# Altium schematic sheet Schematic1P1.schdoc
size 594 x 419 mm; Symbol: Drawing-Symbol_A2; @Project Name: control; @Page Count: 1; @Update Date: 2026-10-01; @Create Date: 2026-09-30; @Schematic Name: Schematic1; @Page No: 1; @Page Name: P1; Company: EasyEDA.com; Version: V1.0; Page Size: A2; Device: Drawing-Symbol_A2; @Create Time: 06:52:32; @Update Time: 20:35:59; Border: 1; Width: 2338; Height: 1652; Region Start: 1; X Region Count: 6; Y Region Count: 4; Blade Width: 10; Title Block Position: 3; @Board Name: Board1
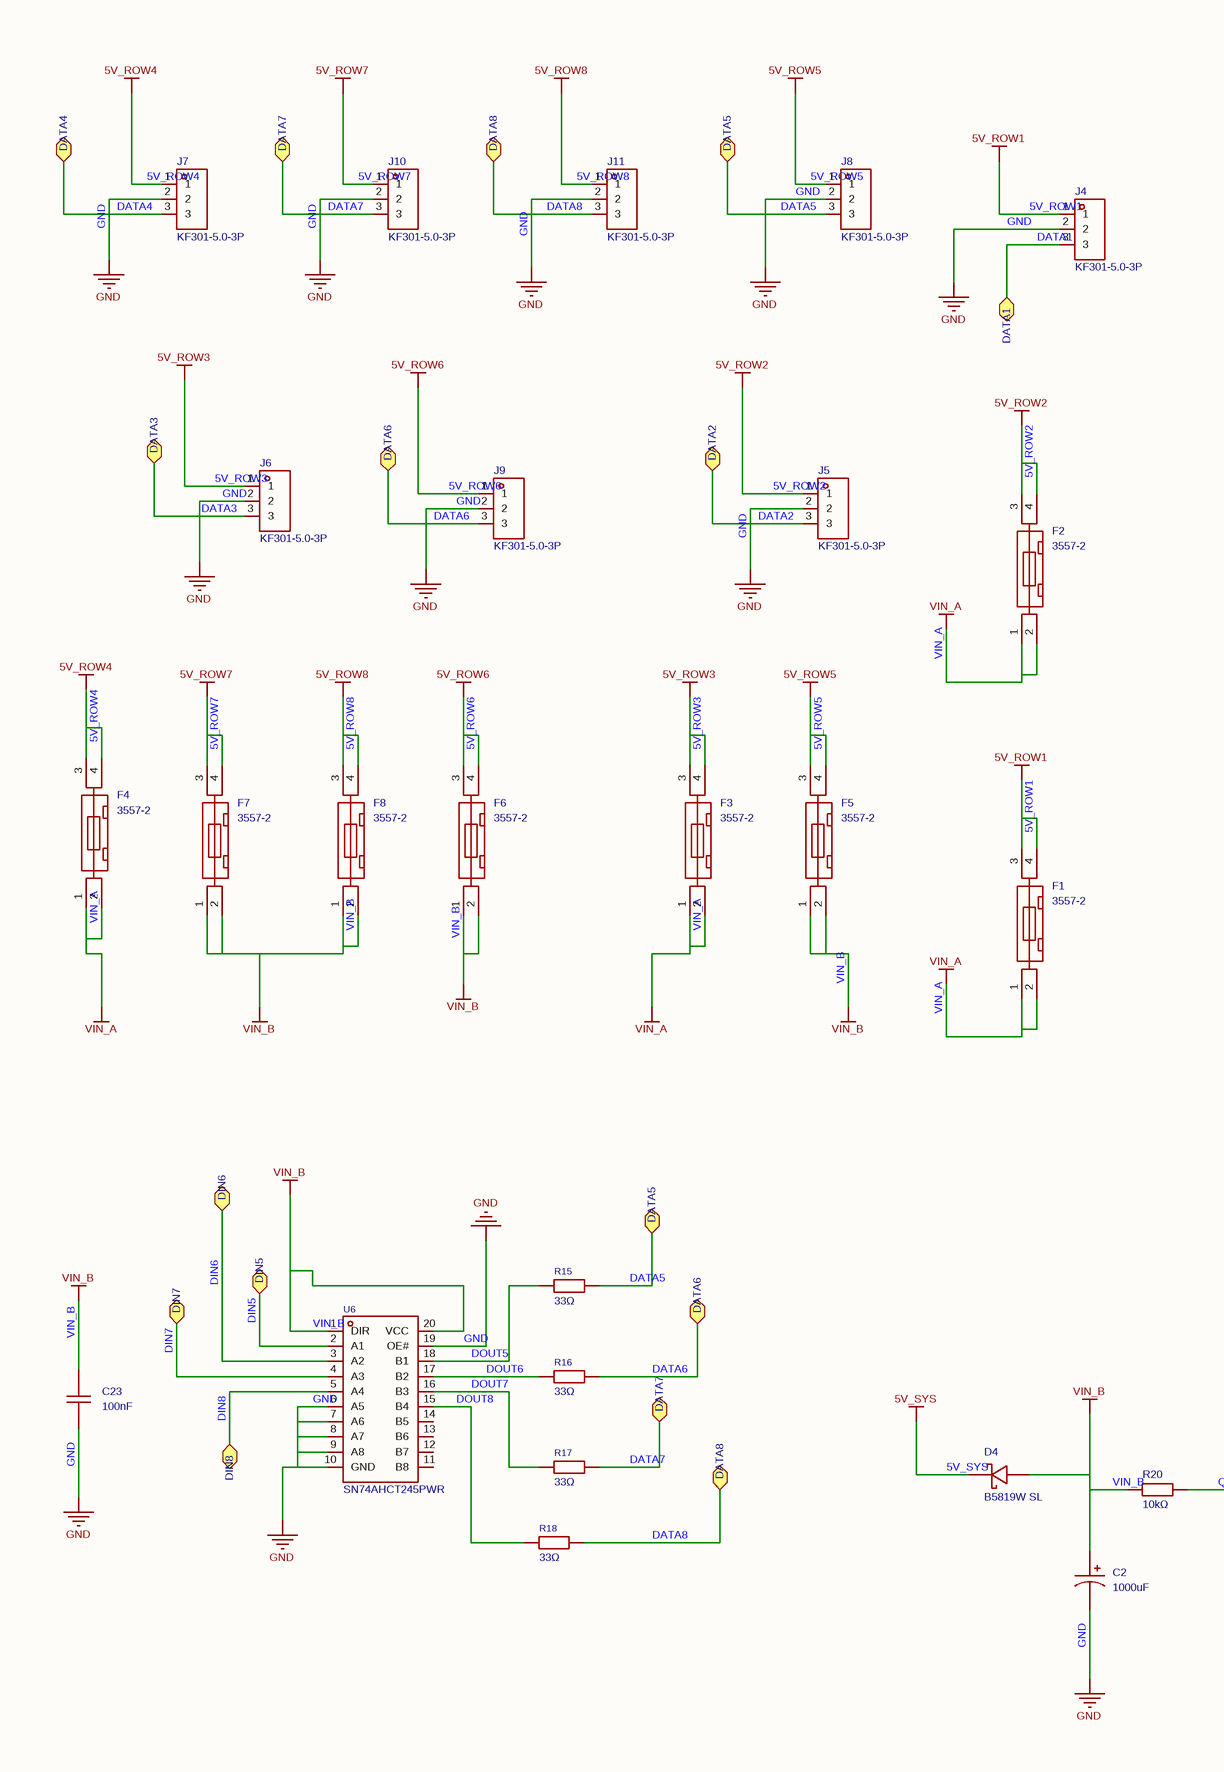
[diagram p0: Schematic1P1.schdoc, left]
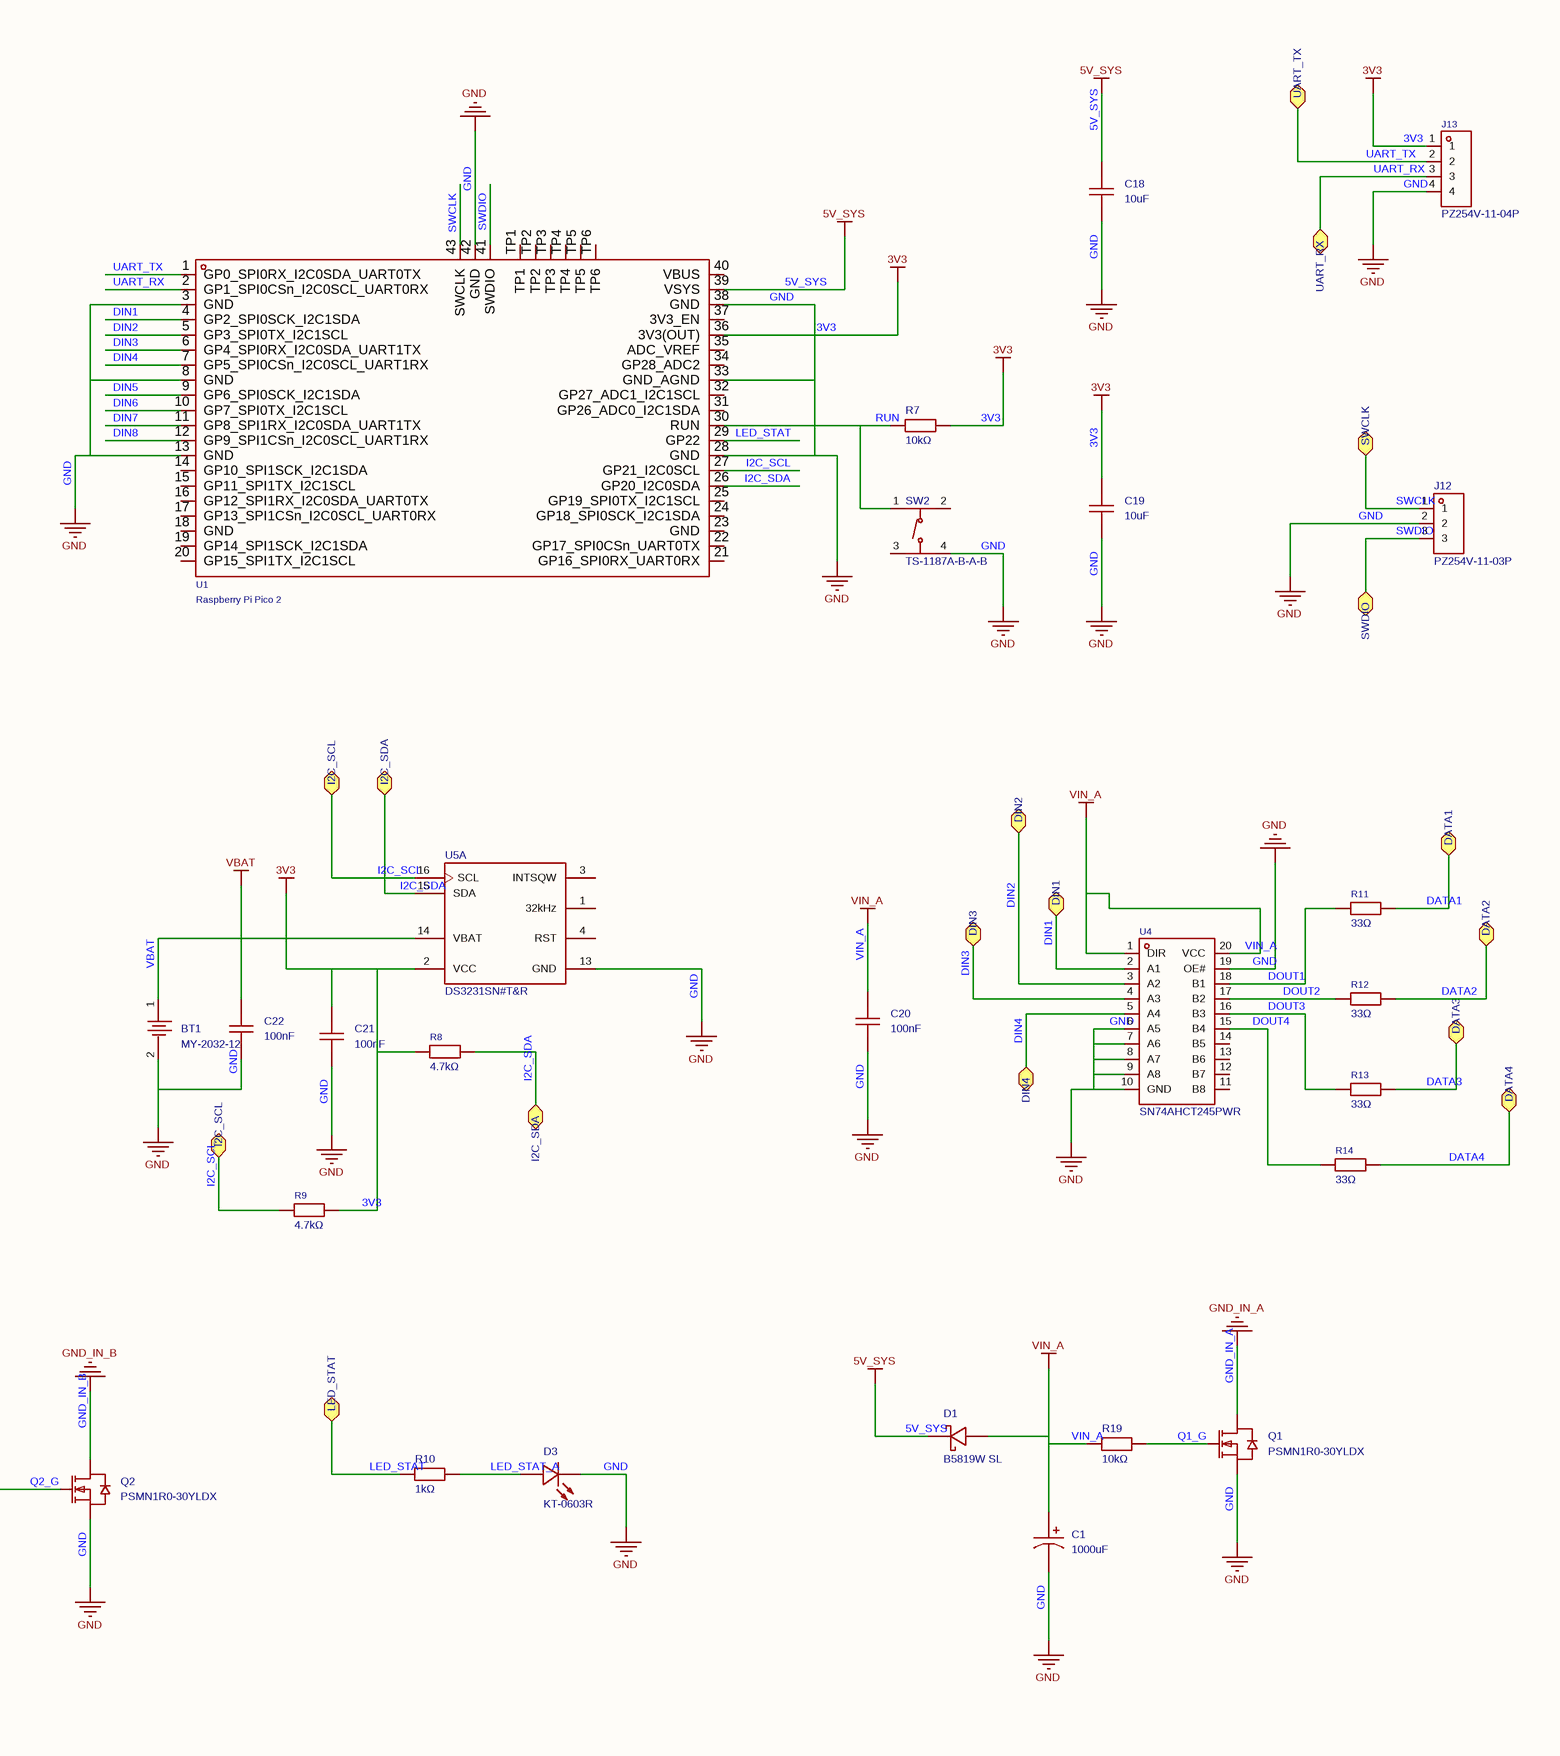
[diagram p1: Schematic1P1.schdoc, right]

## Parts
BT1  MY-2032-12  [BAT-SMD_MY-2032-12]
C1  1000uF  [CAP-SMD_BD10.0-L10.3-W10.3-FD]
C2  1000uF  [CAP-SMD_BD10.0-L10.3-W10.3-FD]
C18  10uF  [C0805]
C19  10uF  [C0805]
C20  100nF  [C0402]
C21  100nF  [C0402]
C22  100nF  [C0402]
C23  100nF  [C0402]
D1  B5819W SL  [SOD-123_L2.7-W1.6-LS3.7-RD-1]
D3  KT-0603R  [LED-SMD_L1.6-W0.8-R-RD]
D4  B5819W SL  [SOD-123_L2.7-W1.6-LS3.7-RD-1]
F1  3557-2  [FUSE-TH_4P-L19.8-W6.7_3557-2]
F2  3557-2  [FUSE-TH_4P-L19.8-W6.7_3557-2]
F3  3557-2  [FUSE-TH_4P-L19.8-W6.7_3557-2]
F4  3557-2  [FUSE-TH_4P-L19.8-W6.7_3557-2]
F5  3557-2  [FUSE-TH_4P-L19.8-W6.7_3557-2]
F6  3557-2  [FUSE-TH_4P-L19.8-W6.7_3557-2]
F7  3557-2  [FUSE-TH_4P-L19.8-W6.7_3557-2]
F8  3557-2  [FUSE-TH_4P-L19.8-W6.7_3557-2]
J4  KF301-5.0-3P  [CONN-TH_3P-P5.00_KF301-5.0-3P]
J5  KF301-5.0-3P  [CONN-TH_3P-P5.00_KF301-5.0-3P]
J6  KF301-5.0-3P  [CONN-TH_3P-P5.00_KF301-5.0-3P]
J7  KF301-5.0-3P  [CONN-TH_3P-P5.00_KF301-5.0-3P]
J8  KF301-5.0-3P  [CONN-TH_3P-P5.00_KF301-5.0-3P]
J9  KF301-5.0-3P  [CONN-TH_3P-P5.00_KF301-5.0-3P]
J10  KF301-5.0-3P  [CONN-TH_3P-P5.00_KF301-5.0-3P]
J11  KF301-5.0-3P  [CONN-TH_3P-P5.00_KF301-5.0-3P]
J12  PZ254V-11-03P  [HDR-TH_3P-P2.54-V-M]
J13  PZ254V-11-04P  [HDR-TH_4P-P2.54-V-M]
Q1  PSMN1R0-30YLDX  [LFPAK56-4_L4.9-W4.2-P1.27-LS6.2-BL]
Q2  PSMN1R0-30YLDX  [LFPAK56-4_L4.9-W4.2-P1.27-LS6.2-BL]
R7  10kΩ  [R0402]
R8  4.7kΩ  [R0402]
R9  4.7kΩ  [R0402]
R10  1kΩ  [R0402]
R11  33Ω  [R0402]
R12  33Ω  [R0402]
R13  33Ω  [R0402]
R14  33Ω  [R0402]
R15  33Ω  [R0402]
R16  33Ω  [R0402]
R17  33Ω  [R0402]
R18  33Ω  [R0402]
R19  10kΩ  [R0402]
R20  10kΩ  [R0402]
SW2  TS-1187A-B-A-B  [SW-SMD_4P-L5.1-W5.1-P3.70-LS6.5-TL_H1.5]
U1  Raspberry Pi Pico 2  [COMM-SMD_L51.0-W21.0-P2.54_SC0916]
U4  SN74AHCT245PWR  [TSSOP-20_L6.5-W4.4-P0.65-LS6.4-BL]
U5  DS3231SN#T&R  [SOIC-16_L10.3-W7.5-P1.27-LS10.3-BL]  (part A of 2)
U6  SN74AHCT245PWR  [TSSOP-20_L6.5-W4.4-P0.65-LS6.4-BL]

## Ports
DATA1 (bidir), DATA2 (bidir), DATA3 (bidir), DATA4 (bidir), DATA5 (bidir), DATA6 (bidir), DATA7 (bidir), DATA8 (bidir), DIN1 (bidir), DIN2 (bidir), DIN3 (bidir), DIN4 (bidir), DIN5 (bidir), DIN6 (bidir), DIN7 (bidir), DIN8 (bidir), I2C_SCL (bidir), I2C_SDA (bidir), LED_STAT (bidir), SWCLK (bidir), SWDIO (bidir), UART_RX (bidir), UART_TX (bidir)

## Nets
3V3: C19.1 C21.1 J13.1 R7.2 R8.2 R9.2 U1.36(3V3(OUT)) U5.2(VCC)
5V_ROW1: F1.3 F1.4 J4.1
5V_ROW2: F2.3 F2.4 J5.1
5V_ROW3: F3.3 F3.4 J6.1
5V_ROW4: F4.3 F4.4 J7.1
5V_ROW5: F5.3 F5.4 J8.1
5V_ROW6: F6.3 F6.4 J9.1
5V_ROW7: F7.3 F7.4 J10.1
5V_ROW8: F8.3 F8.4 J11.1
5V_SYS: C18.1 D1.1(-) D4.1(-) U1.39(VSYS)
GND: BT1.2 C1.2 C2.2 C18.2 C19.2 C20.2 C21.2 C22.2 C23.2 D3.2(K) J4.2 J5.2 J6.2 J7.2 J8.2 J9.2 J10.2 J11.2 J12.2 J13.4 Q1.1(S) Q1.2(S) Q1.3(S) Q2.1(S) Q2.2(S) Q2.3(S) SW2.4(D) U1.3(GND) U1.8(GND) U1.13(GND) U1.28(GND) U1.33(GND_AGND) U1.38(GND) U1.42(GND) U4.6(A5) U4.7(A6) U4.8(A7) U4.9(A8) U4.10(GND) U4.19(OE#) U5.13(GND) U6.6(A5) U6.7(A6) U6.8(A7) U6.9(A8) U6.10(GND) U6.19(OE#)
GND_IN_A: Q1.5(D)
GND_IN_B: Q2.5(D)
VBAT: BT1.1 C22.1 U5.14(VBAT)
VIN_A: C1.1 C20.1 D1.2(+) F1.1 F1.2 F2.1 F2.2 F3.1 F3.2 F4.1 F4.2 R19.1 U4.1(DIR) U4.20(VCC)
VIN_B: C2.1 C23.1 D4.2(+) F5.1 F5.2 F6.1 F6.2 F7.1 F7.2 F8.1 F8.2 R20.1 U6.1(DIR) U6.20(VCC)
DATA1: J4.3 R11.2 ; port DATA1
DATA2: J5.3 R12.2 ; port DATA2
DATA3: J6.3 R13.2 ; port DATA3
DATA4: J7.3 R14.2 ; port DATA4
DATA5: J8.3 R15.2 ; port DATA5
DATA6: J9.3 R16.2 ; port DATA6
DATA7: J10.3 R17.2 ; port DATA7
DATA8: J11.3 R18.2 ; port DATA8
DIN1: U1.4(GP2_SPI0SCK_I2C1SDA) U4.2(A1) ; port DIN1
DIN2: U1.5(GP3_SPI0TX_I2C1SCL) U4.3(A2) ; port DIN2
DIN3: U1.6(GP4_SPI0RX_I2C0SDA_UART1TX) U4.4(A3) ; port DIN3
DIN4: U1.7(GP5_SPI0CSn_I2C0SCL_UART1RX) U4.5(A4) ; port DIN4
DIN5: U1.9(GP6_SPI0SCK_I2C1SDA) U6.2(A1) ; port DIN5
DIN6: U1.10(GP7_SPI0TX_I2C1SCL) U6.3(A2) ; port DIN6
DIN7: U1.11(GP8_SPI1RX_I2C0SDA_UART1TX) U6.4(A3) ; port DIN7
DIN8: U1.12(GP9_SPI1CSn_I2C0SCL_UART1RX) U6.5(A4) ; port DIN8
DOUT1: R11.1 U4.18(B1)
DOUT2: R12.1 U4.17(B2)
DOUT3: R13.1 U4.16(B3)
DOUT4: R14.1 U4.15(B4)
DOUT5: R15.1 U6.18(B1)
DOUT6: R16.1 U6.17(B2)
DOUT7: R17.1 U6.16(B3)
DOUT8: R18.1 U6.15(B4)
I2C_SCL: R9.1 U1.27(GP21_I2C0SCL) U5.16(SCL) ; port I2C_SCL
I2C_SDA: R8.1 U1.26(GP20_I2C0SDA) U5.15(SDA) ; port I2C_SDA
LED_STAT: R10.1 U1.29(GP22) ; port LED_STAT
LED_STAT_A: D3.1(A) R10.2
Q1_G: Q1.4(G) R19.2
Q2_G: Q2.4(G) R20.2
RUN: R7.1 SW2.1(A) U1.30(RUN)
SWCLK: J12.1 U1.43(SWCLK) ; port SWCLK
SWDIO: J12.3 U1.41(SWDIO) ; port SWDIO
UART_RX: J13.3 U1.2(GP1_SPI0CSn_I2C0SCL_UART0RX) ; port UART_RX
UART_TX: J13.2 U1.1(GP0_SPI0RX_I2C0SDA_UART0TX) ; port UART_TX

Not connected (* = marked no-connect by the designer): SW2 2(B) 3(C); U1 14(GP10_SPI1SCK_I2C1SDA) 15(GP11_SPI1TX_I2C1SCL) 16(GP12_SPI1RX_I2C0SDA_UART0TX) 17(GP13_SPI1CSn_I2C0SCL_UART0RX) 18(GND) 19(GP14_SPI1SCK_I2C1SDA) 20(GP15_SPI1TX_I2C1SCL) 21(GP16_SPI0RX_UART0RX) 22(GP17_SPI0CSn_UART0TX) 23(GND) 24(GP18_SPI0SCK_I2C1SDA) 25(GP19_SPI0TX_I2C1SCL) 31(GP26_ADC0_I2C1SDA) 32(GP27_ADC1_I2C1SCL) 34(GP28_ADC2) 35(ADC_VREF) 37(3V3_EN) 40(VBUS) TP1 TP2 TP3 TP4 TP5 TP6; U4 11(B8) 12(B7) 13(B6) 14(B5); U5 1(32kHz) 3(INTSQW) 4(RST); U6 11(B8) 12(B7) 13(B6) 14(B5)

## Notes on the sheet
- Create at
- 2026-09-30
- Schematic
- Board
- Schematic1
- Board1
- Update at
- Page
- 2026-10-01
- P1
- Drawn
- Reviewed
- control
- Version
- V1.0
- Size
- A2
- Page  1  Total  1
- EasyEDA.com

## Library data of the parts
BT1 = MY-2032-12: Type:Battery buckle Operating Temperature:-25~85℃ Contact material:Phosphor bronze Contact coating:Nickel plated Applicable battery specifications:CR2032; Manufacturer: MYOUNG(美阳); EasyEDA Copilot Part Ref: {"uuid":"aa792aee71034bd68fc694e556458b92","libraryUuid":"lcsc"}; Add into BOM: yes; 3D Model: 5e9d120b88ab4f8a9db96ba1f5cb4900; 3D Model Transform: 948.817,617.76239,0,0,0,0,0,0,0; Applicable battery specifications: CR2032; Symbol: MY-2032-12; Device: MY-2032-12; Convert to PCB: yes; LCSC Part Name: MYOUNG(美阳)电池扣CR2032-P28 24.1MM 卧式SMT回流焊工艺标准 T=0.25 适配CR/LIR/ML2032电池; Supplier Part: C964833; Manufacturer Part: MY-2032-12; Supplier Footprint: -; JLCPCB Part Class: Extended Part; Datasheet: https://item.szlcsc.com/datasheet/MY-2032-12/1049799.html; Supplier: LCSC; Type: Battery buckle; Operating Temperature: -25~85℃; Contact material: Phosphor bronze; Contact coating: Nickel plated; FootprintName: BAT-SMD_MY-2032-12; ModelName: BAT-SMD_MY-2032-12
C1 C2 = RVT1C102M1010 1000UF 16V: Capacitance:1000uF Tolerance:±20% Tolerance:±20% Voltage Rating:16V Ripple Current:347mA@120Hz Equivalent Series Resistance(ESR):- Diameter:10mm Height - Seated (Max):10.2mm Lifetime:2800hrs@105℃ Operating Temperature:-55℃~+105℃ Operating Temperature:-55℃; Manufacturer: DMBJ(振宝佳); EasyEDA Copilot Part Ref: {"uuid":"ecdc1e1f0322484094d94e682efabee2","libraryUuid":"lcsc"}; Symbol: RVT1C102M1010_C970714; Add into BOM: yes; 3D Model: f9399d38f4bf4dafaa6a7aeba7f82438; 3D Model Transform: 456.692,405.511,0,180,0,0,0,0,0; Tolerance: ±20%; Voltage Rating: 16V; Device: RVT1C102M1010 1000UF 16V; Convert to PCB: yes; LCSC Part Name: 1000uF ±20% 16V; Supplier Part: C970714; Manufacturer Part: RVT1C102M1010 1000UF 16V; Supplier Footprint: SMD,D10xL10.2mm; JLCPCB Part Class: Extended Part; Datasheet: https://item.szlcsc.com/datasheet/RVT1C102M1010%25201000UF%252016V/1060442.html; Supplier: LCSC; Value: 1000uF; Ripple Current: 347mA@120Hz; Equivalent Series Resistance(ESR): -; Diameter: 10mm; Height - Seated (Max): 10.2mm; Lifetime: 2800hrs@105℃; Operating Temperature: -55℃~+105℃; FootprintName: CAP-SMD_BD10.0-L10.3-W10.3-FD; ModelName: CAP-SMD_BD10.0-L10.3-W10.3-FD
C18 C19 = CL21A106KAYNNNE_C15850: Capacitance:10uF Tolerance:±10% Tolerance:±10% Voltage Rating:25V Temperature Coefficient:X5R; Manufacturer: SAMSUNG(三星); EasyEDA Copilot Part Ref: {"uuid":"e10bc30d72324129a5b7daae4e75f56f","libraryUuid":"lcsc"}; Add into BOM: yes; 3D Model: 8c88e81f49c6409b980720ec8953afb6; 3D Model Transform: 78.74,51.181,0,0,0,0,0,0.0005,0; Tolerance: ±10%; Voltage Rating: 25V; Temperature Coefficient: X5R; ModelName: C0805_L2.0-W1.3-H1.3; Symbol: CL21A106KAYNNNE; Device: CL21A106KAYNNNE_C15850; Convert to PCB: yes; LCSC Part Name: 10uF ±10% 25V; Supplier Part: C15850; Manufacturer Part: CL21A106KAYNNNE; Supplier Footprint: 0805; JLCPCB Part Class: Basic Part; Datasheet: https://item.szlcsc.com/datasheet/CL21A106KAYNNNE/16532.html; Supplier: LCSC; Value: 10uF; FootprintName: C0805
C20-C23 = CL05B104KO5NNNC: Capacitance:100nF Tolerance:±10% Tolerance:±10% Voltage Rating:16V Temperature Coefficient:X7R; Manufacturer: SAMSUNG(三星); EasyEDA Copilot Part Ref: {"uuid":"2eaf9ba597d94b93917d2b625402739a","libraryUuid":"lcsc"}; Add into BOM: yes; 3D Model: b7d13df3e9464d7a99d0651d1a5b4d57; 3D Model Transform: 39.37,19.685,0,0,0,0,0,0,0; Tolerance: ±10%; Voltage Rating: 16V; Temperature Coefficient: X7R; ModelName: C0402_L1.0-W0.5-H0.5; Symbol: CL05B104KO5NNNC; Device: CL05B104KO5NNNC; Convert to PCB: yes; LCSC Part Name: 100nF ±10% 16V; Supplier Part: C1525; Manufacturer Part: CL05B104KO5NNNC; Supplier Footprint: 0402; JLCPCB Part Class: Basic Part; Datasheet: https://item.szlcsc.com/datasheet/CL05B104KO5NNNC/1877.html; Supplier: LCSC; Value: 100nF; FootprintName: C0402
D1 D4 = B5819W SL: Voltage - Forward(Vf@If):600mV@1A Voltage - DC Reverse(Vr):40V Current - Rectified:1A Non-Repetitive Peak Forward Surge Current:9A; Manufacturer: CJ(江苏长电/长晶); EasyEDA Copilot Part Ref: {"uuid":"dcfb33231bcc4449a01b4bb8a60e3d79","libraryUuid":"lcsc"}; Symbol: B5819W_C8598; Add into BOM: yes; 3D Model: 5a61cd31046d4447ba73169a45a0935b; 3D Model Transform: 151.575,66.929,0,0,0,0,0,0,0; Voltage - DC Reverse(Vr): 40V; Current - Rectified: 1A; Non-Repetitive Peak Forward Surge Current: 9A; Device: B5819W SL; Convert to PCB: yes; LCSC Part Name: 电压:40V 电流:1A; Supplier Part: C8598; Manufacturer Part: B5819W SL; Supplier Footprint: SOD-123; JLCPCB Part Class: Basic Part; Datasheet: https://item.szlcsc.com/datasheet/B5819W%2520SL/9093.html; Supplier: LCSC; Voltage - Forward(Vf@If): 600mV@1A; FootprintName: SOD-123_L2.7-W1.6-LS3.7-RD-1; ModelName: SOD-123_L2.7-W1.6-LS3.7-RD-1
D3 = KT-0603R: Lamp Holder Type:1.6mm x 0.8mm square LED Illumination Color:Red Voltage - Forward(Vf):1.8V~2.4V Voltage - Forward(Vf):1.8V~2.4V Power(Watts):40mW Forward Current:20mA Wavelength - Dominant:615nm~630nm Wavelength - Dominant:615nm~630nm Peak Wavelength:645; Manufacturer: KENTO; EasyEDA Copilot Part Ref: {"uuid":"015cbd77079d4b0ea5c81b79fefdcea3","libraryUuid":"lcsc"}; Add into BOM: yes; 3D Model: 19cc79473bbc420a8203ad67d1a57d42; 3D Model Transform: 63.7794,31.496,0,0,0,0,0,0,0; Illumination Color: Red; Power(Watts): 40mW; Forward Current: 20mA; Peak Wavelength: 645nm; Diode Configuration: Discrete Diode; Lens Color: Water Clear; Luminous Intensity: 300mcd; Viewing Angle: 120°; ModelName: LED0603_L1.6-W0.8-H0.6; Symbol: KT-0603R; Device: KT-0603R; Convert to PCB: yes; LCSC Part Name: 0603 红灯 高亮; Supplier Part: C2286; Manufacturer Part: KT-0603R; Supplier Footprint: 0603; JLCPCB Part Class: Basic Part; Datasheet: https://item.szlcsc.com/datasheet/KT-0603R/2659.html; Supplier: LCSC; Lamp Holder Type: 1.6mm x 0.8mm square LED; Voltage - Forward(Vf): 1.8V~2.4V; Wavelength - Dominant: 615nm~630nm; Color Temperature: -; Mounting Style: -; Operating Temperature: -40℃~+85℃; FootprintName: LED-SMD_L1.6-W0.8-R-RD
F1-F8 = 3557-2: Fuseholder Type:Bracket type Number of Circuits:1 Voltage Rating:500V Current Rating:30A Fuse Type:Blade; Manufacturer: Keystone; EasyEDA Copilot Part Ref: {"uuid":"5841bf4d38b740719161dcaa374993cc","libraryUuid":"lcsc"}; Add into BOM: yes; 3D Model: f7701db4c1d948578b2a7da261242b5d; 3D Model Transform: 779.9984,265.39313,0,0,0,0,0,0,-110.236; Number of Circuits: 1; Voltage Rating: 500V; Current Rating: 30A; Fuse Type: Blade; Symbol: 3557-2; Device: 3557-2; Convert to PCB: yes; LCSC Part Name: 30A 500V 支座型; Supplier Part: C352820; Manufacturer Part: 3557-2; Supplier Footprint: -; JLCPCB Part Class: Extended Part; Datasheet: https://item.szlcsc.com/datasheet/3557-2/328627.html; Supplier: LCSC; Fuseholder Type: Bracket type; FootprintName: FUSE-TH_4P-L19.8-W6.7_3557-2; ModelName: FUSE-TH_4P-L19.8-W6.7_3557-2
J4-J11 = KF301-5.0-3P: Number of Positions or Pins:1x3P Pitch:5mm Color:Blue Mounting Type:Through Hole Number of Pins:3P Number of Rows:1 Number of PINs Per Row:3 Screw Specification:M2.5 Current Rating:17A Voltage Rating (Max):250V Wire Gauge - AWG:14~22 Wire Gauge - mm2:1.5; Manufacturer: KEFA(科发); EasyEDA Copilot Part Ref: {"uuid":"629e1ce12aff4686affcbb22439c06da","libraryUuid":"lcsc"}; Add into BOM: yes; 3D Model: 63ddadcc19dd4c19a2d81516611c4ca6; 3D Model Transform: 606.298,303.149,0,0,0,0,7.874,5.905,-165.354; Number of Positions or Pins: 1x3P; Pitch: 5mm; Number of PINs Per Row: 3; Screw Specification: M2.5; Current Rating: 17A; Voltage Rating (Max): 250V; Wire Gauge - AWG: 14~22; Wire Gauge - mm2: 1.5; Symbol: KF301-5.0-3P; Device: KF301-5.0-3P; Convert to PCB: yes; LCSC Part Name: 1x3P 5mm 直插 排数:1 每排P数:3; Supplier Part: C474882; Manufacturer Part: KF301-5.0-3P; Supplier Footprint: 插件,P=5mm; JLCPCB Part Class: Extended Part; Datasheet: https://item.szlcsc.com/datasheet/KF301-5.0-3P/481500.html; Supplier: LCSC; Color: Blue; Mounting Type: Through Hole; Number of Pins: 3P; Number of Rows: 1; Operating Temperature: -30℃~+120℃; Height Above Board: 10mm; FootprintName: CONN-TH_3P-P5.00_KF301-5.0-3P; ModelName: CONN-TH_3P-P5.00_KF301-5.0-3P
J12 = PZ254V-11-03P_C492402: Pin Structure:1x3P Pitch:2.54mm Row Spacing:- Circluar Pins/Square Pins:Pin Header Mounting Type:Through Hole Number of Rows:1 Number of Pins:3P Current Rating:3A Voltage Rating (Max):250V Length of Mating Pin:6mm Insulation Height:2.5mm Length of End Con; Manufacturer: XFCN(兴飞); EasyEDA Copilot Part Ref: {"uuid":"3d472c23b2204deab7cf7a842d521d9c","libraryUuid":"lcsc"}; Add into BOM: yes; 3D Model: b83490ae987a4919a987f9b45fc060bc; 3D Model Transform: 300.03877,100,0,0,0,0,0,0,-118.11; Pin Structure: 1x3P; Pitch: 2.54mm; Current Rating: 3A; Voltage Rating (Max): 250V; ModelName: HDR-TH_3P-P2.54-M-LI-1X3P; Symbol: PZ254V-11-03P; Device: PZ254V-11-03P_C492402; Convert to PCB: yes; LCSC Part Name: 1x3P 间距:2.54mm 方针 直插; Supplier Part: C492402; Manufacturer Part: PZ254V-11-03P; Supplier Footprint: 插件,P=2.54mm; JLCPCB Part Class: Extended Part; Datasheet: https://item.szlcsc.com/datasheet/PZ254V-11-03P/502958.html; Supplier: LCSC; Row Spacing: -; Circluar Pins/Square Pins: Pin Header; Mounting Type: Through Hole; Number of Rows: 1; Number of Pins: 3P; Length of Mating Pin: 6mm; Insulation Height: 2.5mm; Length of End Connection Pin: 3mm; Contact Material: Brass; Contact Plating: -; Operating Temperature: -40℃~+105℃; Color: Black; FootprintName: HDR-TH_3P-P2.54-V-M
J13 = PZ254V-11-04P: Pin Structure:1x4P Pitch:2.54mm Row Spacing:- Circluar Pins/Square Pins:Square pin Mounting Type:Through Hole Number of Rows:1 Number of Pins:4P Current Rating:3A Voltage Rating (Max):250V Length of Mating Pin:6.1mm Insulation Height:2.5mm Length of End C; Manufacturer: XFCN(兴飞); EasyEDA Copilot Part Ref: {"uuid":"f70eda5267b34d9799800488a27be0c6","libraryUuid":"lcsc"}; Symbol: PZ254V-11-04P_C2691448; Add into BOM: yes; 3D Model: 69e0934d9b9245f6ab499bc5a319b3aa; 3D Model Transform: 399.999,104.7242,0,0,0,0,0,0,-118.11; Pin Structure: 1x4P; Pitch: 2.54mm; Current Rating: 3A; Voltage Rating (Max): 250V; ModelName: HDR-TH_4P-P2.54-M-LI-1X4P; Device: PZ254V-11-04P; Convert to PCB: yes; LCSC Part Name: 1x4P 间距:2.54mm 方针 直插; Supplier Footprint: 插件,P=2.54mm; Datasheet: https://item.szlcsc.com/datasheet/PZ254V-11-04P/2801085.html; Row Spacing: -; Circluar Pins/Square Pins: Square pin; Mounting Type: Through Hole; Number of Rows: 1; Number of Pins: 4P; Length of Mating Pin: 6.1mm; Insulation Height: 2.5mm; Length of End Connection Pin: 3mm; Contact Material: Brass; Contact Plating: Gold; Operating Temperature: -40℃~+105℃; Color: Black; Manufacturer Part: PZ254V-11-04P; Supplier: LCSC; Supplier Part: C2691448; JLCPCB Part Class: Extended Part; FootprintName: HDR-TH_4P-P2.54-V-M
Q1 Q2 = PSMN1R0-30YLDX: Number:1 N-channel Drain to Source Voltage:30V Current - Continuous Drain(Id):300A RDS(on):1.3mΩ@4.5V Pd - Power Dissipation:238W Gate Threshold Voltage (Vgs(th)):1.2V Gate Charge(Qg):57.3nC@4.5V Input Capacitance(Ciss):8.598nF Reverse Transfer Capacitanc; Manufacturer: Nexperia(安世); EasyEDA Copilot Part Ref: {"uuid":"5345bbc3d4d3432791adeda5bc97666b","libraryUuid":"lcsc"}; Symbol: PSMN1R0-30YLDX_C478145; Add into BOM: yes; 3D Model: b92c4a7530e54d4bb3570371fe948e9c; 3D Model Transform: 192.913,246.50356,0,0,0,0,-0.0005,32.412,0; Drain to Source Voltage: 30V; Current - Continuous Drain(Id): 300A; Pd - Power Dissipation: 238W; Gate Threshold Voltage (Vgs(th)): 1.2V; Reverse Transfer Capacitance (Crss@Vds): 510pF; Output Capacitance(Coss): 2.424nF; Vgs: ±20V; ModelName: LFPAK56-4_L4.9-W4.2-H1.1-LS6.2-P1.27; Device: PSMN1R0-30YLDX; Convert to PCB: yes; LCSC Part Name: 1个N沟道 耐压:30V 电流:300A; Supplier Part: C478145; Manufacturer Part: PSMN1R0-30YLDX; Supplier Footprint: LFPAK-56; JLCPCB Part Class: Extended Part; Datasheet: https://item.szlcsc.com/datasheet/PSMN1R0-30YLDX/485276.html; Supplier: LCSC; Number: 1 N-channel; RDS(on): 1.3mΩ@4.5V; Gate Charge(Qg): 57.3nC@4.5V; Input Capacitance(Ciss): 8.598nF; Operating Temperature: -55℃~+175℃; Configuration: -; Type: N-Channel; FootprintName: LFPAK56-4_L4.9-W4.2-P1.27-LS6.2-BL
R7 R19 R20 = 0402WGF1002TCE: Type:Thick Film Resistor Resistance:10kΩ Tolerance:±1% Tolerance:±1% Power(Watts):62.5mW Voltage-Supply(Max):50V Temperature Coefficient:±100ppm/℃ Temperature Coefficient:±100ppm/℃ Operating Temperature:-55℃~+155℃ Operating Temperature:-55℃~+155℃; Manufacturer: UNI-ROYAL(厚声); EasyEDA Copilot Part Ref: {"uuid":"ffb8c4ed7d7244bc918e37313d4ca373","libraryUuid":"lcsc"}; Add into BOM: yes; 3D Model: efdecb7dae4442949d28eecaf748420f; 3D Model Transform: 39.37,19.685,0,0,0,0,0,0,0; Tolerance: ±1%; Power(Watts): 62.5mW; Voltage-Supply(Max): 50V; ModelName: R0402_L1.0-W0.5-H0.4; Symbol: 0402WGF1002TCE; Device: 0402WGF1002TCE; Convert to PCB: yes; LCSC Part Name: 厚膜电阻 10kΩ ±1%; Supplier Part: C25744; Manufacturer Part: 0402WGF1002TCE; Supplier Footprint: 0402; JLCPCB Part Class: Basic Part; Datasheet: https://item.szlcsc.com/datasheet/0402WGF1002TCE/26487.html; Supplier: LCSC; Type: Thick Film Resistor; Value: 10kΩ; Temperature Coefficient: ±100ppm/℃; Operating Temperature: -55℃~+155℃; FootprintName: R0402
R8 R9 = 0402WGF4701TCE: Type:Thick Film Resistor Resistance:4.7kΩ Tolerance:±1% Tolerance:±1% Power(Watts):62.5mW Voltage-Supply(Max):50V Temperature Coefficient:±100ppm/℃ Temperature Coefficient:±100ppm/℃ Operating Temperature:-55℃~+155℃ Operating Temperature:-55℃~+155℃; Manufacturer: UNI-ROYAL(厚声); EasyEDA Copilot Part Ref: {"uuid":"542db4fb88de4c59bd539781e5a30727","libraryUuid":"lcsc"}; Add into BOM: yes; 3D Model: efdecb7dae4442949d28eecaf748420f; 3D Model Transform: 39.37,19.685,0,0,0,0,0,0,0; Tolerance: ±1%; Power(Watts): 62.5mW; Voltage-Supply(Max): 50V; ModelName: R0402_L1.0-W0.5-H0.4; Symbol: 0402WGF4701TCE; Device: 0402WGF4701TCE; Convert to PCB: yes; LCSC Part Name: 厚膜电阻 4.7kΩ ±1%; Supplier Footprint: 0402; Datasheet: https://item.szlcsc.com/datasheet/0402WGF4701TCE/26643.html; Type: Thick Film Resistor; Temperature Coefficient: ±100ppm/℃; Operating Temperature: -55℃~+155℃; Manufacturer Part: 0402WGF4701TCE; Supplier: LCSC; Supplier Part: C25900; Value: 4.7kΩ; JLCPCB Part Class: Basic Part; FootprintName: R0402
R10 = 0402WGF1001TCE: Type:Thick Film Resistor Resistance:1kΩ Tolerance:±1% Tolerance:±1% Power(Watts):62.5mW Voltage-Supply(Max):50V Temperature Coefficient:±100ppm/℃ Temperature Coefficient:±100ppm/℃ Operating Temperature:-55℃~+155℃ Operating Temperature:-55℃~+155℃; Manufacturer: UNI-ROYAL(厚声); EasyEDA Copilot Part Ref: {"uuid":"17aa4e57569d4d22adc28d945ba5559d","libraryUuid":"lcsc"}; Add into BOM: yes; 3D Model: efdecb7dae4442949d28eecaf748420f; 3D Model Transform: 39.37,19.685,0,0,0,0,0,0,0; Tolerance: ±1%; Power(Watts): 62.5mW; Voltage-Supply(Max): 50V; ModelName: R0402_L1.0-W0.5-H0.4; Symbol: 0402WGF1001TCE; Device: 0402WGF1001TCE; Convert to PCB: yes; LCSC Part Name: 厚膜电阻 1kΩ ±1%; Supplier Part: C11702; Manufacturer Part: 0402WGF1001TCE; Supplier Footprint: 0402; JLCPCB Part Class: Basic Part; Datasheet: https://item.szlcsc.com/datasheet/0402WGF1001TCE/12256.html; Supplier: LCSC; Type: Thick Film Resistor; Value: 1kΩ; Temperature Coefficient: ±100ppm/℃; Operating Temperature: -55℃~+155℃; FootprintName: R0402
R11-R18 = 0402WGF330JTCE: Type:Thick Film Resistor Resistance:33Ω Tolerance:±1% Tolerance:±1% Power(Watts):62.5mW Voltage-Supply(Max):50V Temperature Coefficient:±100ppm/℃ Temperature Coefficient:±100ppm/℃ Operating Temperature:-55℃~+155℃ Operating Temperature:-55℃~+155℃; Manufacturer: UNI-ROYAL(厚声); EasyEDA Copilot Part Ref: {"uuid":"1f1e772b30d54f119255cd0da7dd806e","libraryUuid":"lcsc"}; Add into BOM: yes; 3D Model: efdecb7dae4442949d28eecaf748420f; 3D Model Transform: 39.37,19.685,0,0,0,0,0,0,0; Tolerance: ±1%; Power(Watts): 62.5mW; Voltage-Supply(Max): 50V; ModelName: R0402_L1.0-W0.5-H0.4; Symbol: 0402WGF330JTCE; Device: 0402WGF330JTCE; Convert to PCB: yes; LCSC Part Name: 33Ω ±1% 62.5mW 厚膜电阻; Supplier Footprint: 0402; Datasheet: https://item.szlcsc.com/datasheet/0402WGF330JTCE/25848.html; Type: Thick Film Resistor; Temperature Coefficient: ±100ppm/℃; Operating Temperature: -55℃~+155℃; Manufacturer Part: 0402WGF330JTCE; Supplier: LCSC; Supplier Part: C25105; Value: 33Ω; JLCPCB Part Class: Basic Part; FootprintName: R0402
SW2 = TS-1187A-B-A-B: Circuit:SPST Actuator Style:Round Button Operating Force:1.6N Mounting Type:Surface Mount,Vertical Length:5.1mm Width:5.1mm Switch Height:1.5mm with Bracket:Without Bracket Contact Current:50mA Voltage Rating:12V Actuator/Cap Color:Gold With Lamp:No Life:; Manufacturer: XKB Connection(中国星坤); EasyEDA Copilot Part Ref: {"uuid":"38630614a58f4650bd5eefe9a5f79d9a","libraryUuid":"lcsc"}; Add into BOM: yes; 3D Model: 297e93217c8a461096f3cf9cc3d4db3d; 3D Model Transform: 255.905,204.76337,0,0,0,0,0,0,0; Circuit: SPST; Operating Force: 1.6N; Switch Height: 1.5mm; Contact Current: 50mA; Voltage Rating: 12V; Actuator/Cap Color: Gold; With Lamp: No; Life: 100,000 cycles; Symbol: TS-1187A-B-A-B; Device: TS-1187A-B-A-B; Convert to PCB: yes; LCSC Part Name: 5.1*5.1*1.5mm 立贴 轻触开关; Supplier Part: C318884; Manufacturer Part: TS-1187A-B-A-B; Supplier Footprint: SMD-4P,5.1x5.1mm; JLCPCB Part Class: Basic Part; Datasheet: https://item.szlcsc.com/datasheet/TS-1187A-B-A-B/299976.html; Supplier: LCSC; Actuator Style: Round Button; Mounting Type: Surface Mount,Vertical; Length: 5.1mm; Width: 5.1mm; with Bracket: Without Bracket; Operating Temperature: -30℃~+85℃; FootprintName: SW-SMD_4P-L5.1-W5.1-P3.70-LS6.5-TL_H1.5; ModelName: SW-SMD_4P-L5.1-W5.1-P3.70-LS6.5-TL_H1.5
U1 = Raspberry Pi Pico 2: Manufacturer: Raspberry Pi(树莓派); EasyEDA Copilot Part Ref: {"uuid":"ada0e71d22964a69b82d617050663b4a","libraryUuid":"lcsc"}; Symbol: PICO 2; Add into BOM: yes; Device: Raspberry Pi Pico 2; Convert to PCB: yes; LCSC Part Name: SC1631; Supplier Part: C41407547; Manufacturer Part: Raspberry Pi Pico 2; Supplier Footprint: -; JLCPCB Part Class: Extended Part; Datasheet: https://item.szlcsc.com/datasheet/Raspberry%2520Pi%2520Pico%25202/43207606.html; Supplier: LCSC; FootprintName: COMM-SMD_L51.0-W21.0-P2.54_SC0916
U4 U6 = SN74AHCT245PWR: Input type:- output type:Tri-State Voltage - Supply:4.5V~5.5V Voltage - Supply:4.5V~5.5V Number of Elements:1 Number of Bits per Element:8 Channel Type:Bidirectional Current - Output Low(IOL):8mA Current - Output High(IOH):8mA Logic Family:74AHCT Operatin; Manufacturer: TI(德州仪器); EasyEDA Copilot Part Ref: {"uuid":"a6b100c5c97e48b39b99135927fd2510","libraryUuid":"lcsc"}; Add into BOM: yes; 3D Model: d00c537554e8428abe371c2c4fe2166f; 3D Model Transform: 251.969,255.906,0,90,0,0,0.0005,0,0; Number of Elements: 1; Number of Bits per Element: 8; Current - Output Low(IOL): 8mA; Logic Family: 74AHCT; Quiescent Current: 40uA; Propagation Delay: 9.5ns@5V,50pF; ModelName: TSSOP-20_L6.5-W4.4-H1.0-LS6.4-P0.65; Symbol: SN74AHCT245PWR; Device: SN74AHCT245PWR; Convert to PCB: yes; LCSC Part Name: 三态输出，八路总线收发器; Supplier Footprint: TSSOP-20; Datasheet: https://www.ti.com/cn/lit/ds/symlink/sn74ahct245.pdf; Input type: -; output type: Tri-State; Voltage - Supply: 4.5V~5.5V; Channel Type: Bidirectional; Current - Output High(IOH): 8mA; Operating Temperature: -40℃~+125℃; Features: Output enable; Manufacturer Part: SN74AHCT245PWR; Supplier: LCSC; Supplier Part: C10910; JLCPCB Part Class: Extended Part; FootprintName: TSSOP-20_L6.5-W4.4-P0.65-LS6.4-BL
U5 = DS3231SN#T&R: Interface:I2C crystal oscillator:Built-in Alarm Output:Yes Current - Supply:200uA Voltage - Supply:2.3V~5.5V Voltage - Supply:2.3V~5.5V Quiescent Current(Iq):0.84uA Operating Temperature:-40℃~+85℃ Operating Temperature:-40℃~+85℃ Features:Temperature compe; Manufacturer: ADI(亚德诺)/MAXIM(美信); EasyEDA Copilot Part Ref: {"uuid":"57db6f0ecafe419d946ac382cac0db8c","libraryUuid":"lcsc"}; Add into BOM: yes; Relevance: []; 3D Model: 649b7cb6adae474980397c0a68e6a41c; 3D Model Transform: 405.511,409.68154,0,0,0,0,-0.0005,0,0; Interface: I2C; Current - Supply: 200uA; Quiescent Current(Iq): 0.84uA; ModelName: SOIC-16_L10.3-W7.5-H2.7-LS10.3-P1.27; Symbol: DS3231SN#; Device: DS3231SN#T&R; Convert to PCB: yes; LCSC Part Name: 超高精度、I²C接口、集成RTC/TCXO/晶体; Supplier Part: C9866; Manufacturer Part: DS3231SN#T&R; Supplier Footprint: SOIC-16-300mil; JLCPCB Part Class: Extended Part; Datasheet: https://item.szlcsc.com/datasheet/DS3231SN%2523T%2526R/10398.html; Supplier: LCSC; crystal oscillator: Built-in; Alarm Output: Yes; Voltage - Supply: 2.3V~5.5V; Operating Temperature: -40℃~+85℃; Features: Temperature compensation；Alarm function；Programmable clock output; FootprintName: SOIC-16_L10.3-W7.5-P1.27-LS10.3-BL